# Altium project PCB_Project.PrjPcb
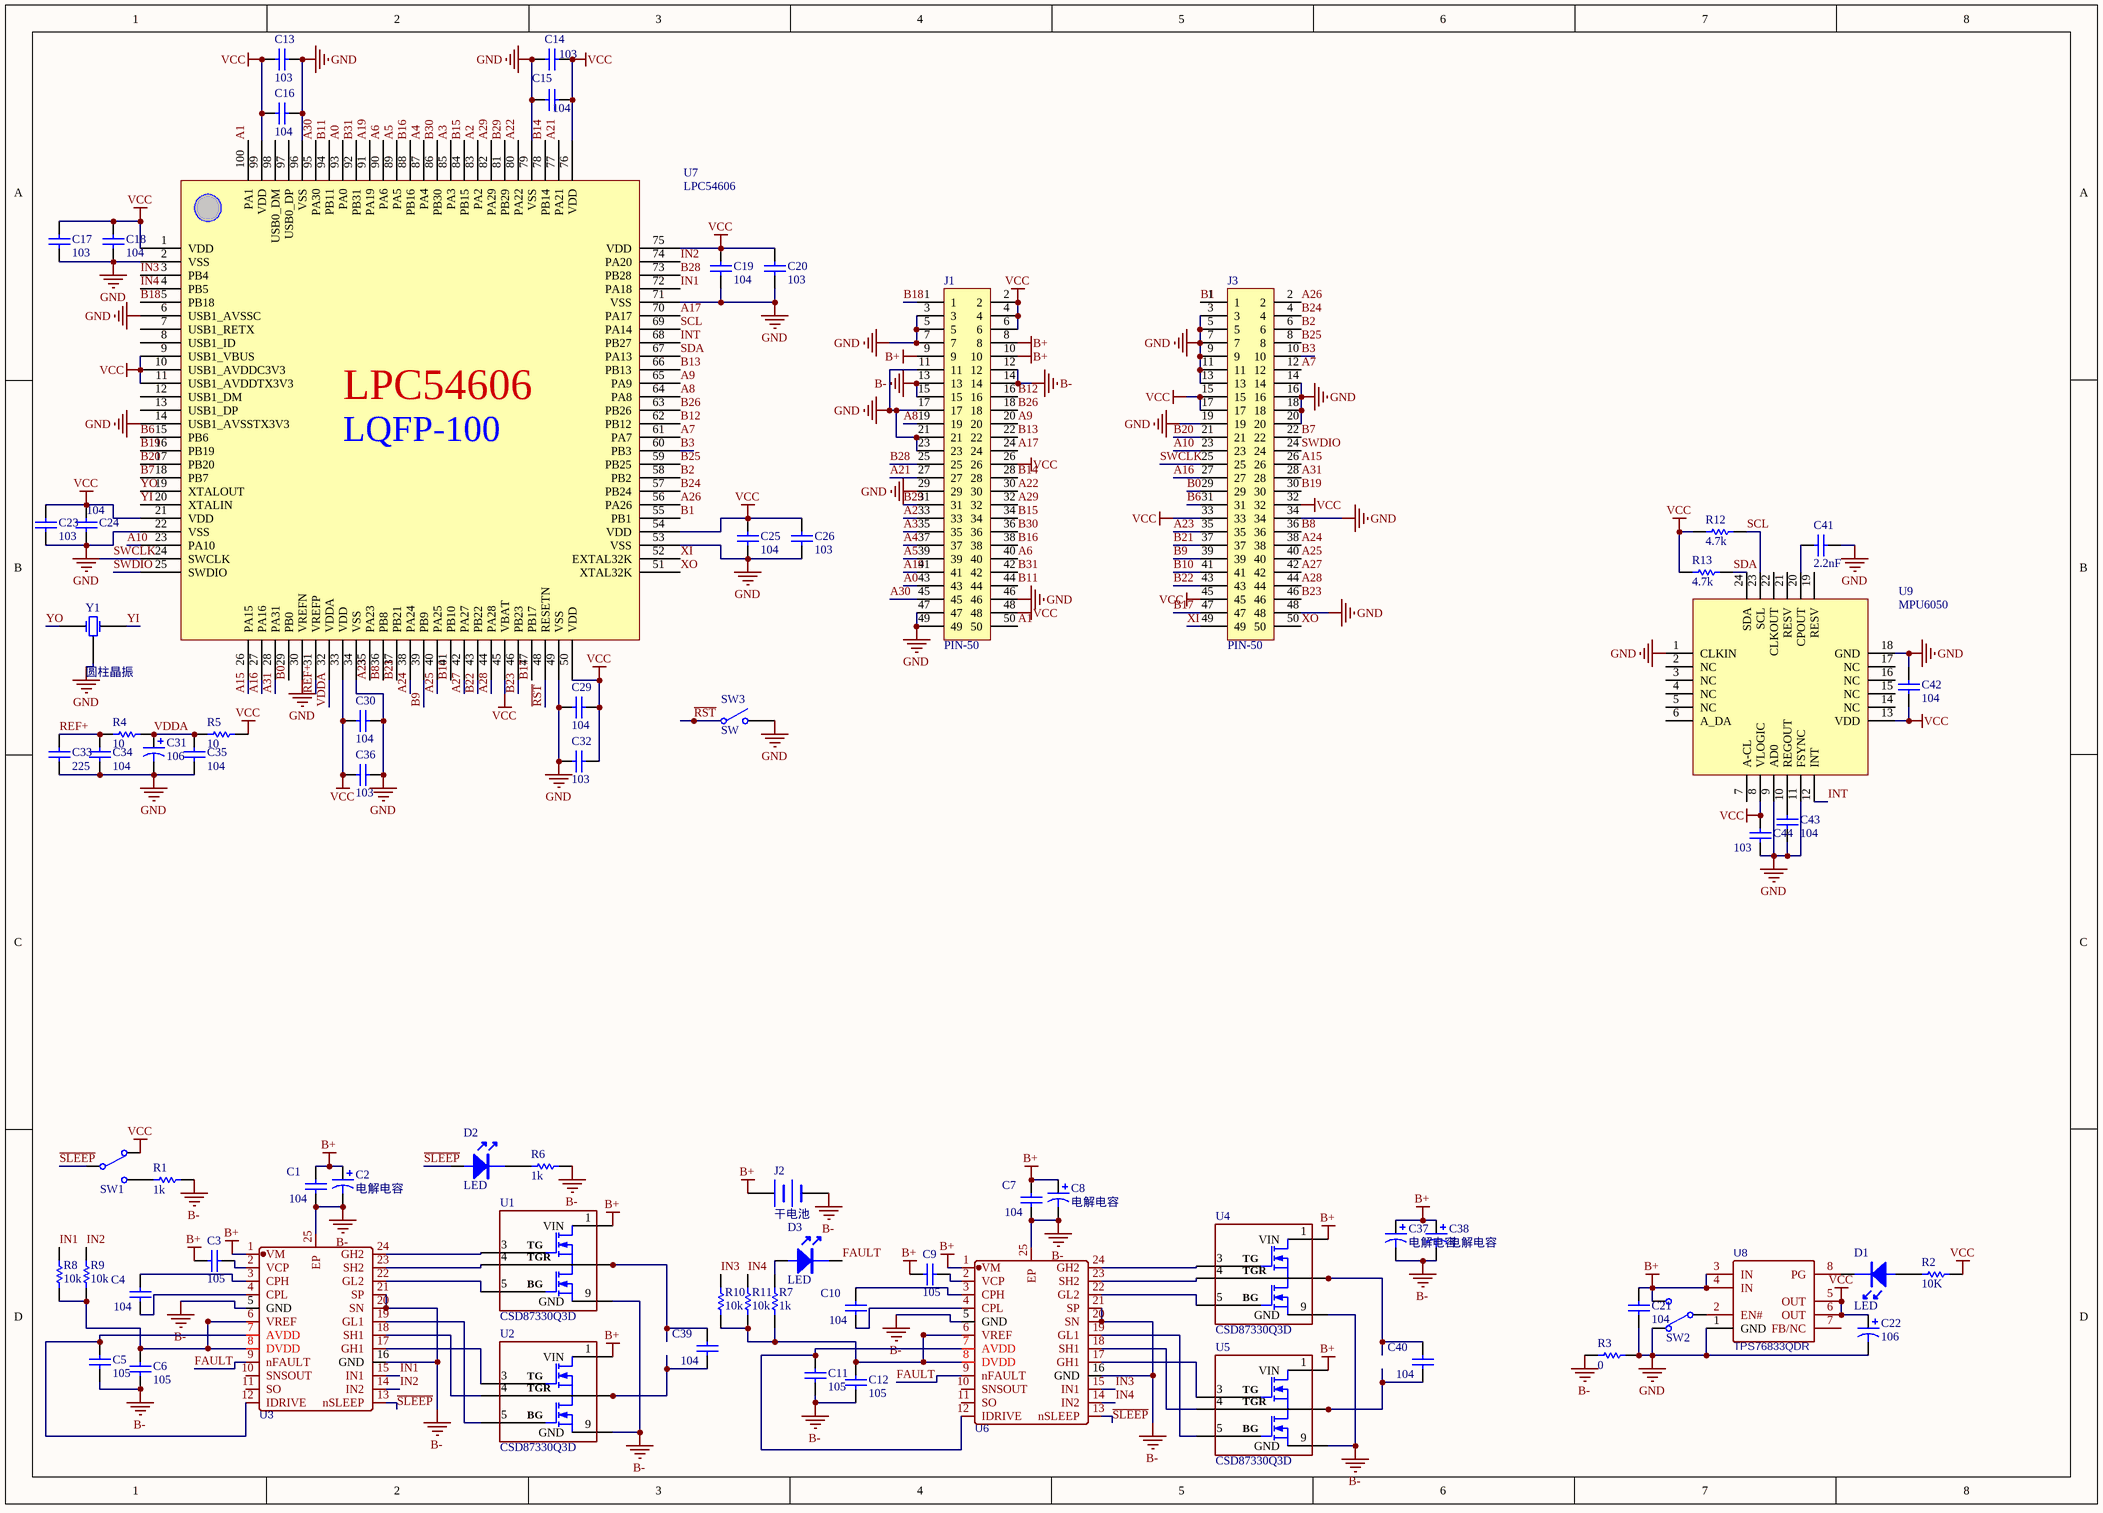
[diagram p0: 原理图.SchDoc]
1 sheet, 74 parts. Net scope: global (net labels, ports and power ports of the same name join across sheets).
Board file: 4层.PcbDoc

## Sheet 原理图.SchDoc
size A3

### Parts
C1  104  [C0402]
C2  电解电容  [贴片电解 4*5.4]
C3  105  [C0603]
C4  104  [C0402]
C5  105  [C0402]
C6  105  [C0402]
C7  104  [C0402]
C8  电解电容  [贴片电解 4*5.4]
C9  105  [C0603]
C10  104  [C0402]
C11  105  [C0402]
C12  105  [C0402]
C13  103  [C0402]
C14  103  [C0402]
C15  104  [C0402]
C16  104  [C0402]
C17  103  [C0402]
C18  104  [C0402]
C19  104  [C0402]
C20  103  [C0402]
C21  104  [C0402]
C22  106  [3216-ce]
C23  103  [C0402]
C24  104  [C0402]
C25  104  [C0402]
C26  103  [C0402]
C29  104  [C0402]
C30  104  [C0402]
C31  106  [3216-ce]
C32  103  [C0402]
C33  225  [C0603]
C34  104  [C0402]
C35  104  [C0402]
C36  103  [C0402]
C37  电解电容  [贴片电解 4*5.4]
C38  电解电容  [贴片电解 4*5.4]
C39  104  [C0402]
C40  104  [C0402]
C41  2.2nF  [C0402]
C42  104  [C0402]
C43  104  [C0402]
C44  103  [C0402]
D1  LED  [LED 0603G]
D2  LED  [LED 0603G]
D3  LED  [LED 0603G]
J1  PIN-50  [50PDF12-0.5母]
J2  干电池  [T接头]
J3  PIN-50  [50PDF12-0.5母]
R1  1k  [R0402]
R2  10K  [R0402]
R3  0  [R0603]
R4  10  [R0603]
R5  10  [R0603]
R6  1k  [R0402]
R7  1k  [R0402]
R8  10k  [R0402]
R9  10k  [R0402]
R10  10k  [R0402]
R11  10k  [R0402]
R12  4.7k  [R0402]
R13  4.7k  [R0402]
SW1  K3-1235S-K1  [K3-1235S-K1]  (value not drawn)
SW2  K3-1235S-K1  [K3-1235S-K1]  (value not drawn)
SW3  SW  [按键微动开关2]
U1  CSD87330Q3D  [LSON-CLIP-8]
U2  CSD87330Q3D  [LSON-CLIP-8]
U3  DRV8701ERGET  [VQFN-24_24PIN-L4.00-W4.00-PITCH0.50-EP-TL]  (value not drawn)
U4  CSD87330Q3D  [LSON-CLIP-8]
U5  CSD87330Q3D  [LSON-CLIP-8]
U6  DRV8701ERGET  [VQFN-24_24PIN-L4.00-W4.00-PITCH0.50-EP-TL]  (value not drawn)
U7  LPC54606  [LQFP100]
U8  TPS76833QDR  [SOIC8-3.9MM]
U9  MPU6050  [QFN-24_4x4x05P]
Y1  圆柱晶振  [OSC-3213CSTSE800G52-R0]

### Nets
B+: C1.2 C2.1 C3.1 C7.2 C8.1 C9.1 C21.2 C37.1 C38.1 J1.8 J1.9 J1.10 J2.1(+) SW2.3 U1.1(VIN) U2.1(VIN) U3.1(VM) U4.1(VIN) U5.1(VIN) U6.1(VM) U8.3(IN) U8.4(IN)
B-: C1.1 C2.2 C5.1 C6.1 C7.1 C8.2 C11.1 C12.1 C37.2 C38.2 J1.12 J1.13 J1.14 J1.15 J2.2(-) R1.1 R3.2 R6.2 U1.9(GND) U2.9(GND) U3.5(GND) U3.16(GND) U3.20(SN) U3.21(SP) U3.25(EP) U4.9(GND) U5.9(GND) U6.5(GND) U6.16(GND) U6.20(SN) U6.21(SP) U6.25(EP)
GND: C13.2 C14.1 C15.1 C16.2 C17.1 C18.1 C19.2 C20.2 C21.1 C22.2 C23.1 C24.1 C25.2 C26.2 C29.2 C30.1 C31.2 C32.2 C33.1 C34.1 C35.1 C36.1 C41.2 C42.1 C43.2 C44.2 J1.3 J1.5 J1.7 J1.11 J1.17 J1.21 J1.23 J1.29 J1.46 J1.47 J1.49 J3.3 J3.5 J3.7 J3.9 J3.11 J3.13 J3.14 J3.16 J3.18 J3.19 J3.20 J3.34 J3.48 R3.1 SW2.1 SW3.2(NO) U7.2(VSS) U7.6(USB1_AVSSC) U7.14(USB1_AVSSTX3V3) U7.22(VSS) U7.30(VREFN) U7.34(VSS) U7.49(VSS) U7.53(VSS) U7.71(VSS) U7.79(VSS) U7.96(VSS) U8.1(GND) U9.1(CLKIN) U9.9(AD0) U9.11(FSYNC) U9.18(GND) Y1.3(OSC2)
VCC: C13.1 C14.2 C15.2 C16.1 C17.2 C18.2 C19.1 C20.1 C22.1 C23.2 C24.2 C25.1 C26.1 C29.1 C30.2 C32.1 C36.2 C42.2 C44.1 J1.2 J1.4 J1.6 J1.26 J1.48 J3.15 J3.17 J3.32 J3.33 J3.45 R2.1 R5.1 R12.1 R13.1 SW1.1 U7.1(VDD) U7.9(USB1_VBUS) U7.10(USB1_AVDDC3V3) U7.11(USB1_AVDDTX3V3) U7.21(VDD) U7.33(VDD) U7.45(VBAT) U7.50(VDD) U7.54(VDD) U7.75(VDD) U7.76(VDD) U7.99(VDD) U8.5(OUT) U8.6(OUT) U9.8(VLOGIC) U9.13(VDD)
~{RST}: SW3.1(COMMON) U7.48(RESETN)
~{SLEEP}: D2.A SW1.2 U3.13(nSLEEP) U6.13(nSLEEP)
A0: J1.43 U7.93(PA0)
A1: J1.50 U7.100(PA1)
A2: J1.33 U7.83(PA2)
A3: J1.35 U7.85(PA3)
A4: J1.37 U7.87(PA4)
A5: J1.39 U7.89(PA5)
A6: J1.40 U7.90(PA6)
A7: J3.12 U7.61(PA7)
A8: J1.19 U7.64(PA8)
A9: J1.20 U7.65(PA9)
A10: J3.23 U7.23(PA10)
A15: J3.26 U7.26(PA15)
A16: J3.27 U7.27(PA16)
A17: J1.24 U7.70(PA17)
A19: J1.41 U7.91(PA19)
A21: J1.27 U7.77(PA21)
A22: J1.30 U7.80(PA22)
A23: J3.35 U7.35(PA23)
A24: J3.38 U7.38(PA24)
A25: J3.40 U7.40(PA25)
A26: J3.2 U7.56(PA26)
A27: J3.42 U7.42(PA27)
A28: J3.44 U7.44(PA28)
A29: J1.32 U7.82(PA29)
A30: J1.45 U7.95(PA30)
A31: J3.28 U7.28(PA31)
B0: J3.29 U7.29(PB0)
B1: J3.1 U7.55(PB1)
B2: J3.6 U7.58(PB2)
B3: J3.10 U7.60(PB3)
B6: J3.31 U7.15(PB6)
B7: J3.22 U7.18(PB7)
B8: J3.36 U7.36(PB8)
B9: J3.39 U7.39(PB9)
B10: J3.41 U7.41(PB10)
B11: J1.44 U7.94(PB11)
B12: J1.16 U7.62(PB12)
B13: J1.22 U7.66(PB13)
B14: J1.28 U7.78(PB14)
B15: J1.34 U7.84(PB15)
B16: J1.38 U7.88(PB16)
B17: J3.47 U7.47(PB17)
B18: J1.1 U7.5(PB18)
B19: J3.30 U7.16(PB19)
B20: J3.21 U7.17(PB20)
B21: J3.37 U7.37(PB21)
B22: J3.43 U7.43(PB22)
B23: J3.46 U7.46(PB23)
B24: J3.4 U7.57(PB24)
B25: J3.8 U7.59(PB25)
B26: J1.18 U7.63(PB26)
B28: J1.25 U7.73(PB28)
B29: J1.31 U7.81(PB29)
B30: J1.36 U7.86(PB30)
B31: J1.42 U7.92(PB31)
FAULT: D3.K U3.9(nFAULT) U6.9(nFAULT)
IN1: R8.1 U3.15(IN1) U7.72(PA18)
IN2: R9.1 U3.14(IN2) U7.74(PA20)
IN3: R10.1 U6.15(IN1) U7.3(PB4)
IN4: R11.1 U6.14(IN2) U7.4(PB5)
INT: U7.68(PB27) U9.12(INT)
REF+: C33.2 C34.2 R4.2 U7.31(VREFP)
SCL: R12.2 U7.69(PA14) U9.23(SCL)
SDA: R13.2 U7.67(PA13) U9.24(SDA)
SWCLK: J3.25 U7.24(SWCLK)
SWDIO: J3.24 U7.25(SWDIO)
VDDA: C31.1 C35.2 R4.1 R5.2 U7.32(VDDA)
XI: J3.49 U7.52(EXTAL32K)
XO: J3.50 U7.51(XTAL32K)
YI: U7.20(XTALIN) Y1.2(OSC2)
YO: U7.19(XTALOUT) Y1.1(OSC1)
NetC3_2: C3.2 U3.2(VCP)
NetC4_1: C4.1 U3.4(CPL)
NetC4_2: C4.2 U3.3(CPH)
NetC5_2: C5.2 U3.7(AVDD) U3.12(IDRIVE)
NetC6_2: C6.2 R8.2 R9.2 U3.6(VREF) U3.8(DVDD)
NetC9_2: C9.2 U6.2(VCP)
NetC10_1: C10.1 U6.4(CPL)
NetC10_2: C10.2 U6.3(CPH)
NetC11_2: C11.2 U6.7(AVDD) U6.12(IDRIVE)
NetC12_2: C12.2 R7.2 R10.2 R11.2 U6.6(VREF) U6.8(DVDD)
NetC39_1: C39.1 U2.6(SW) U2.7(SW) U2.8(SW)
NetC39_2: C39.2 U1.6(SW) U1.7(SW) U1.8(SW)
NetC40_1: C40.1 U5.6(SW) U5.7(SW) U5.8(SW)
NetC40_2: C40.2 U4.6(SW) U4.7(SW) U4.8(SW)
NetC41_1: C41.1 U9.20(CPOUT)
NetC43_1: C43.1 U9.10(REGOUT)
NetD1_A: D1.A R2.2
NetD1_K: D1.K U8.8(PG)
NetD2_K: D2.K R6.1
NetD3_A: D3.A R7.1
NetR1_2: R1.2 SW1.3
NetSW2_2: SW2.2 U8.2(EN#)
NetU1_3: U1.3(TG) U3.24(GH2)
NetU1_4: U1.4(TGR) U3.23(SH2)
NetU1_5: U1.5(BG) U3.22(GL2)
NetU2_3: U2.3(TG) U3.17(GH1)
NetU2_4: U2.4(TGR) U3.18(SH1)
NetU2_5: U2.5(BG) U3.19(GL1)
NetU4_3: U4.3(TG) U6.24(GH2)
NetU4_4: U4.4(TGR) U6.23(SH2)
NetU4_5: U4.5(BG) U6.22(GL2)
NetU5_3: U5.3(TG) U6.17(GH1)
NetU5_4: U5.4(TGR) U6.18(SH1)
NetU5_5: U5.5(BG) U6.19(GL1)

Not connected (* = marked no-connect by the designer): U3 10(SNSOUT) 11(SO); U6 10(SNSOUT) 11(SO); U7 7(USB1_RETX) 8(USB1_ID) 12(USB1_DM) 13(USB1_DP) 97(USB0_DP) 98(USB0_DM); U8 7(FB/NC); U9 2(NC) 3(NC) 4(NC) 5(NC) 6(A_DA) 7(A-CL) 14(NC) 15(NC) 16(NC) 17(NC) 19(RESV) 21(RESV) 22(CLKOUT)

### Notes on the sheet
- Title
- Size:
- Date:
- A4
- Number:
- Time:
- Revision:
- Sheet
- of
- File:
- (in symbol LPC54606BD100) LQFP-100

### Library data of the parts
C1 C3-C7 C9-C21 C23-C26 C29 C30 C32-C36 C39-C44 = 电容: Capacitor; Value: 22pF; Published: 8-Jun-2000; LatestRevisionDate: 17-Jul-2002; LatestRevisionNote: Re-released for DXP Platform.; PackageReference: RAD-0.3; Publisher: Altium Limited; PackageDescription: Radial Cap, Thru-Hole; 2 Leads; 0.3 in Pin Spacing
C2 C8 C22 C31 C37 C38 = 电解电容: Polarized Capacitor (Axial); Value: 100pF; Published: 8-Jun-2000; LatestRevisionDate: 17-Jul-2002; LatestRevisionNote: Re-released for DXP Platform.; PackageReference: POLAR0.8; Publisher: Altium Limited; PackageDescription: Polarized Capacitor; 2 Leads
J2 = 干电池: Battery
R1-R13 = 电阻: Resistor; Value: 150R; Published: 8-Jun-2000; LatestRevisionDate: 17-Jul-2002; LatestRevisionNote: Re-released for DXP Platform.; PackageReference: AXIAL-0.3; Publisher: Altium Limited; PackageDescription: Axial Device, Thru-Hole; 2 Leads; 0.3 in Pin Spacing
SW1 SW2 = 单刀双掷: Switch
SW3 = Switch: Single-Pole, Single-Throw Switch
U1 U2 U4 U5 = CSD87330Q3D: 半桥NMOS
U3 U6 = DRV8701: H桥驱动; BOM_Manufacturer: TI; Contributor: LCSC; BOM_Supplier: LCSC; BOM_Manufacturer Part: DRV8701ERGET; BOM_Supplier Part: C132049; spicePre: U
U7 = LPC54606BD100
U8 = TPS76833QDR: BOM_Manufacturer: TI; SMT Type: Extend; BOM_Supplier: LCSC; BOM_Manufacturer Part: TPS76833QDR; image: //image.lceda.cn/szlcsc/C16002.jpg; BOM_Supplier Part: C16002; BOM_LCSC Assembly: Yes; spicePre: U; spiceSymbolName: TPS76833QDR
Y1 = XTAL_3Pin